# Altium schematic sheet Driver2.SchDoc
size A4; SheetNumber: 4; SheetTotal: 8
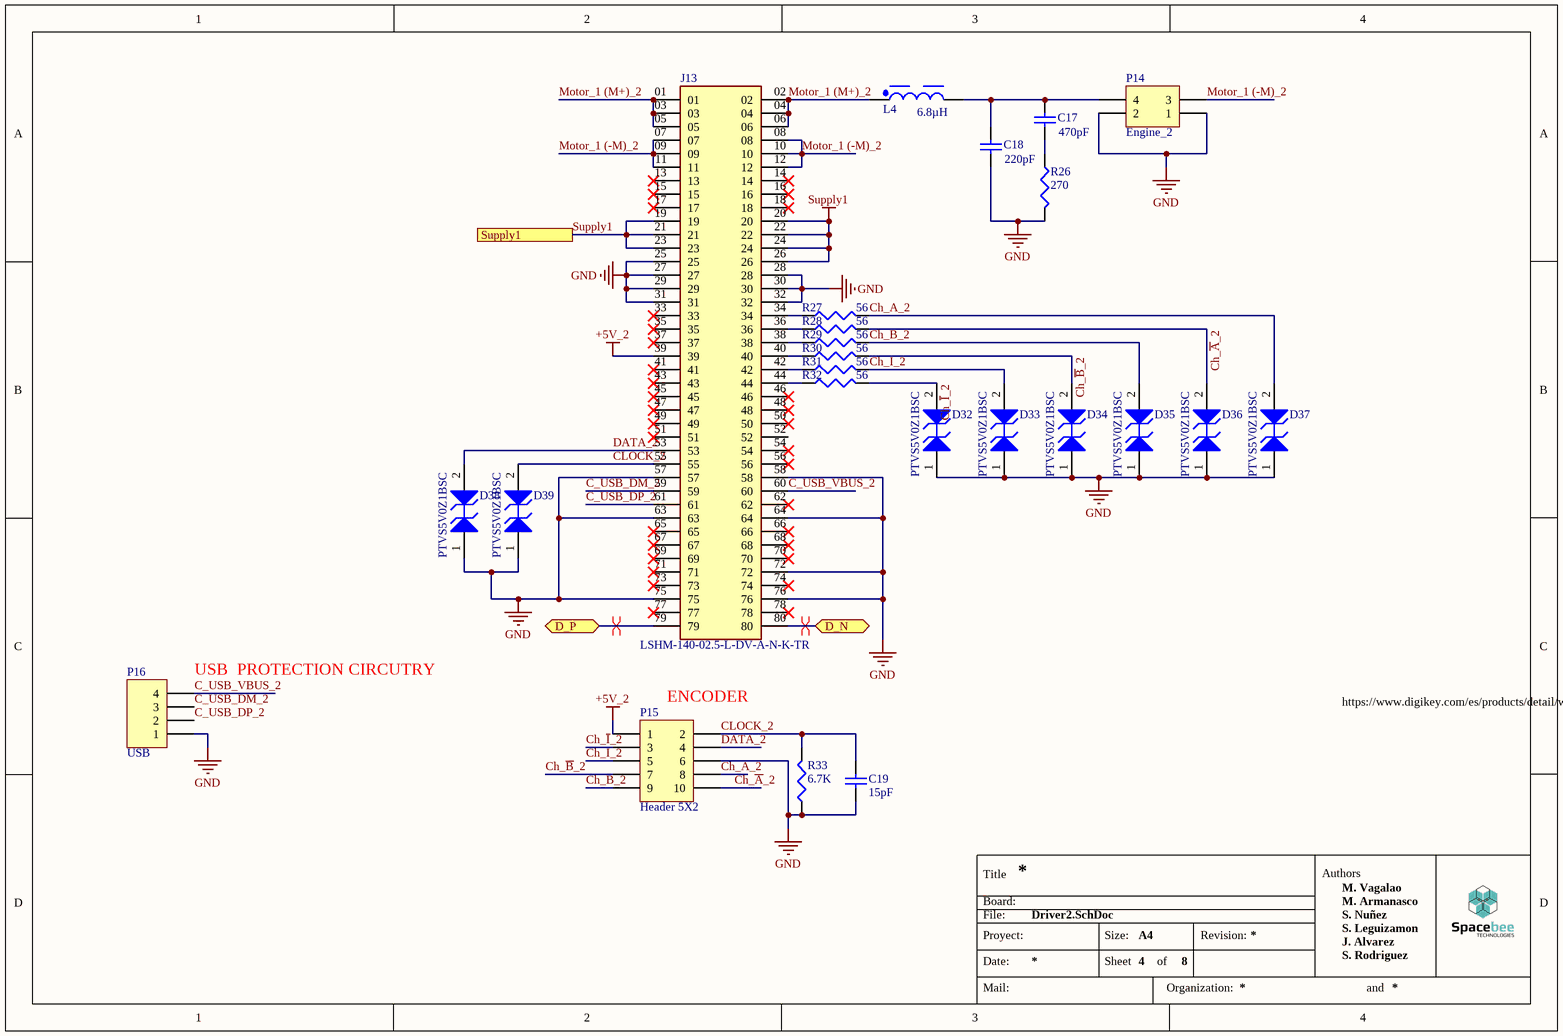
[diagram p0: Driver2.SchDoc]

## Parts
C17  value 470pF  [1608[0603]]  (hidden comment: Cap Semi)
C18  value 220pF  [1608[0603]]  (hidden comment: Cap Semi)
C19  value 15pF  [6-0805_L]  (hidden comment: Cap Semi)
D32  PTVS5V0Z1BSC  [SOD993B]
D33  PTVS5V0Z1BSC  [SOD993B]
D34  PTVS5V0Z1BSC  [SOD993B]
D35  PTVS5V0Z1BSC  [SOD993B]
D36  PTVS5V0Z1BSC  [SOD993B]
D37  PTVS5V0Z1BSC  [SOD993B]
D38  PTVS5V0Z1BSC  [SOD993B]
D39  PTVS5V0Z1BSC  [SOD993B]
J13  LSHM-140-02.5-L-DV-A-N-K-TR  [SAMTEC_LSHM-140-02.5-L-DV-A-N-K-TR]
L4  6.8µH  [WE-XHMA_6060]
P14  Engine_2  [MOLEX_1724480004]
P15  Header 5X2  [CONN_HIF3FC-14PA-2.54DS(71)_HIR]
P16  USB  [Header 4 SMD]
R26  value 270  [J1-0603]  (hidden comment: Res3)
R27  value 56  [J1-0603]  (hidden comment: Res3)
R28  value 56  [J1-0603]  (hidden comment: Res3)
R29  value 56  [J1-0603]  (hidden comment: Res3)
R30  value 56  [J1-0603]  (hidden comment: Res3)
R31  value 56  [J1-0603]  (hidden comment: Res3)
R32  value 56  [J1-0603]  (hidden comment: Res3)
R33  value 6.7K  [J1-0603]  (hidden comment: Res3)

## Ports
D_N (bidir), D_P (bidir), Supply1

## Nets
+5V_2: J13.39 P15.1
GND: C18.2 C19.1 D32.1(A1) D33.1(A1) D34.1(A1) D35.1(A1) D36.1(A1) D37.1(A1) D38.1(A1) D39.1(A1) J13.25 J13.27 J13.28 J13.29 J13.30 J13.31 J13.32 J13.57 J13.58 J13.63 J13.64 J13.72 J13.75 J13.76 P14.1 P14.2 P15.6 P16.1 R26.2 R33.1
Supply1: J13.19 J13.20 J13.21 J13.22 J13.23 J13.24 J13.26 ; port Supply1
C_USB_DM_2: J13.59 P16.3
C_USB_DP_2: J13.61 P16.2
C_USB_VBUS_2: J13.60 P16.4
Ch_~{A}_2: D36.2(A2) P15.10 R28.2
Ch_A_2: D37.2(A2) P15.8 R27.2
Ch_~{B}_2: D34.2(A2) P15.7 R30.2
Ch_B_2: D35.2(A2) P15.9 R29.2
Ch_~{I}_2: D32.2(A2) P15.3 R32.2
Ch_I_2: D33.2(A2) P15.5 R31.2
CLOCK_2: C19.2 D39.2(A2) J13.55 P15.2 R33.2
D_N: J13.80 ; port D_N
D_P: J13.79 ; port D_P
DATA_2: D38.2(A2) J13.53 P15.4
Motor_1 (-M)_2: J13.07 J13.08 J13.09 J13.10 J13.11 J13.12 P14.3
Motor_1 (M+)_2: J13.01 J13.02 J13.03 J13.04 J13.05 J13.06 L4.1
NetC17_1: C17.1 C18.1 L4.2 P14.4
NetC17_2: C17.2 R26.1
NetJ13_34: J13.34 R27.1
NetJ13_36: J13.36 R28.1
NetJ13_38: J13.38 R29.1
NetJ13_40: J13.40 R30.1
NetJ13_42: J13.42 R31.1
NetJ13_44: J13.44 R32.1

Not connected (* = marked no-connect by the designer): J13 13* 14* 15* 16* 17* 18* 33* 35* 37* 41* 43* 45* 46* 47* 48* 49* 50* 51* 52 54* 56* 62* 65* 66* 67* 68* 69* 70* 71* 73* 74* 77* 78*

## Layout directives
differential pair: D_N, D_P

## Notes on the sheet
- (near P16) USB  PROTECTION CIRCUTRY
- (near P15) ENCODER
- https://www.digikey.com/es/products/detail/würth-elektronik/9774050243R/5320640?s=N4IgTCBcDaIJwHYEBYAMBWVZkGYBKIAugL5A
- Title
- Board:
- File:
- Authors
- M. Armanasco
- S. Nuñez
- M. Vagalao
- Proyect:
- Date:
- Mail:
- Size:
- Sheet
- A4
- of
- Organization:
- Revision:
- S. Rodriguez
- S. Leguizamon
- J. Alvarez
- and

## Library data of the parts
C17 C18 = Cap Semi: Capacitor (Semiconductor SIM Model); Published: 8-Jun-2000; LatestRevisionDate: 29-May-2009; LatestRevisionNote: IPC-7351 Footprint Added.; PackageReference: C1206; Publisher: Altium Limited; PackageDescription: Chip Capacitor
C19 = Cap 0805: Capacitor (Semiconductor SIM Model); Published: 8-Jun-2000; LatestRevisionDate: 29-May-2009; LatestRevisionNote: IPC-7351 Footprint Added.; PackageReference: C1206; Publisher: Altium Limited; PackageDescription: Chip Capacitor
D32-D39 = PTVS5V0Z1BSC: Manufacturer: On Semiconductor; PartNumber: 1SMB16CAT3; Direction: Bidirectional; IR Max (uA): 5; Packing: Tape and Reel; PPK Max (W): 600; V(BR) Typ (V): 18.74; DatasheetVersion: Rev. A; PackageVersion: Rev. A, 01/2000; PackageReference: SMB-2-403C-01; PackageDescription: 2-Pin Small Molded Package, J-Bend Lead, Body 4.315 x 3.555 mm; Supplier 1: Digi-Key; Supplier Part Number 1: 1SMB16CAT3OSTR-ND; Supplier 2: Digi-Key; Supplier Part Number 2: 1SMB16CAT3OSCT-ND; Supplier 3: Digi-Key; Supplier Part Number 3: 1SMB16CAT3OSDKR-ND; Mounting Technology: Surface Mount; ComponentLink1Description: Manufacturer URL; ComponentLink1URL: http://www.onsemi.com/; ComponentLink2Description: Datasheet; ComponentLink2URL: http://www.onsemi.com/pub_link/Collateral/1SMB10CAT3-D.PDF; ComponentLink3Description: Package Specification; ComponentLink3URL: http://www.onsemi.com/pub_link/Collateral/1SMB10CAT3-D.PDF
J13 = LSHM-140-02.5-L-DV-A-N-K-TR: LSHM - Samtec 0.50mm Razor Beam High-Speed Hermaphroditic Terminal / Socket Strip.; Price: None; MP: LSHM-140-02.5-L-DV-A-N-K-TR; Availability: Unavailable; Value: *; Package: None
L4 = 78439369068: WE-XHMA SMD Power Inductor, size 1090, 6.8µH, 10.5A, 7.16mΩ; Manufacturer: Wurth Elektronik; Case/Size Code: 1090; Inductance Tolerance: 20%; Saturation Current: 23.25A; Self Resonant Frequency: 16MHz; ComponentLink1Description: Website Link; ComponentLink1URL: https://www.we-online.com/redexpert/article/78439369068?ad; ComponentLink2Description: Datasheet Link; ComponentLink2URL: https://www.we-online.com/redexpert/spec/78439369068?ad; Manufacturer Part Number: 78439369068; Category: Shielded Power Inductors; Match Code: WE-XHMA; Mount: Surface Mount; Operating Temperature Max: 125°C; Operating Temperature Min: -40°C; Packaging: Tape and Reel; Length: 11.6mm; Width: 10.5mm; Height: 8.8mm; DC Resistance: 7.16mΩ; Inductance: 6.8µH; Rated Current: 10.5A
P14 = Header 2X2: Header, 2-Pin, Dual row; LatestRevisionDate: 17-Jul-2002; LatestRevisionNote: Re-released for DXP Platform.; Publisher: Altium Limited
P15 = Header 5X2: Header, 5-Pin, Dual row; LatestRevisionDate: 17-Jul-2002; LatestRevisionNote: Re-released for DXP Platform.; Publisher: Altium Limited
P16 = Header 4 SMD: Header, 4-Pin; LatestRevisionDate: 17-Jul-2002; LatestRevisionNote: Re-released for DXP Platform.; Publisher: Altium Limited
R26-R33 = Res3: Resistor; Published: 8-Jun-2000; LatestRevisionDate: 29-May-2009; LatestRevisionNote: IPC-7351 Footprint Added.; PackageReference: J1-0603; Publisher: Altium Limited; PackageDescription: Chip Resistor